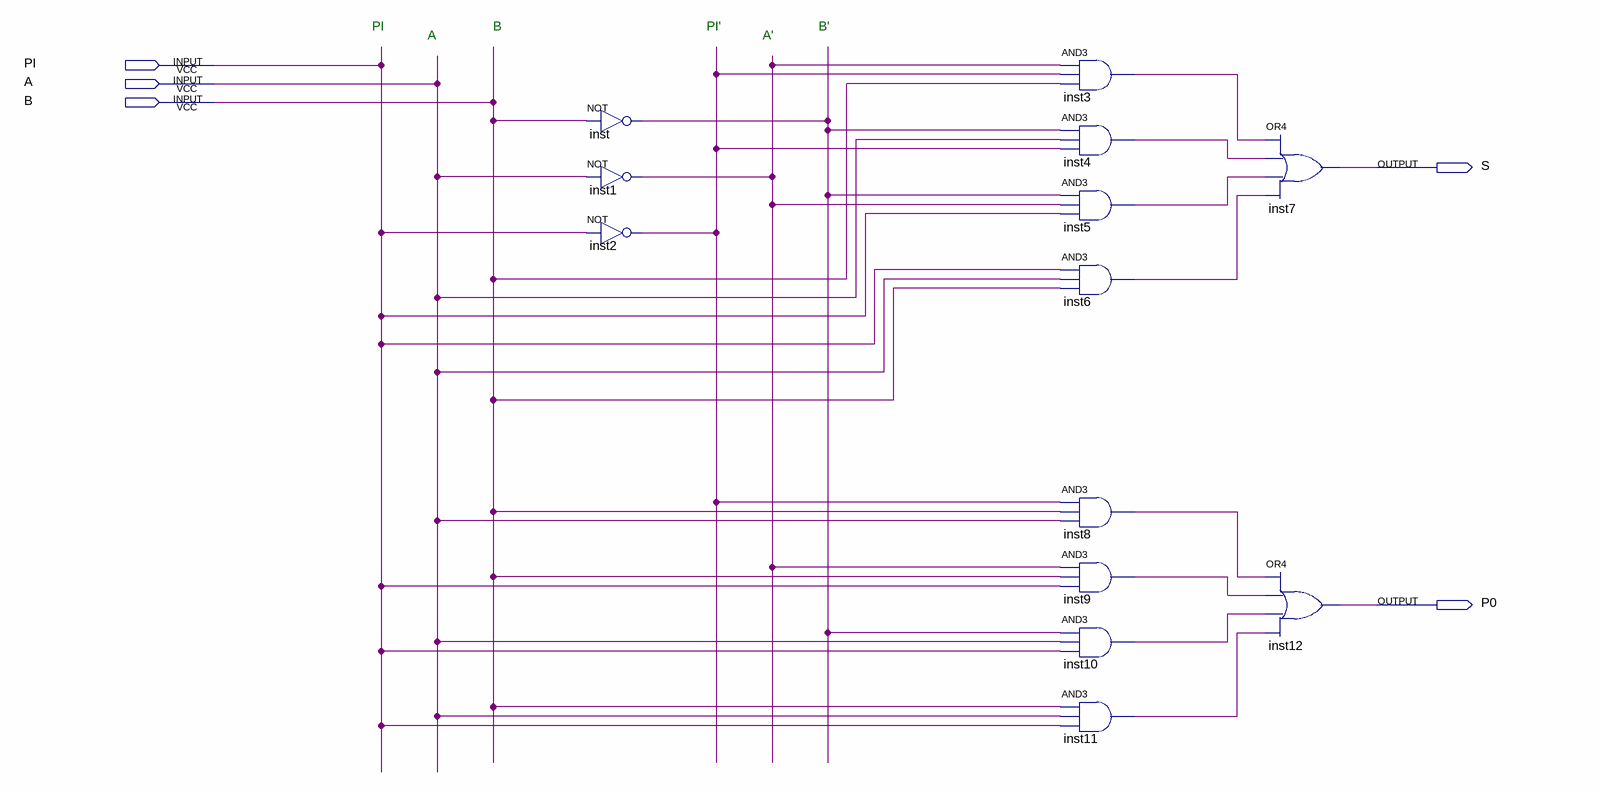
[diagram p0: schematic sheet]
// Quartus schematic Mark12.bdf as structural Verilog: 13 symbols, 5 pins
module Mark12 (
  input  PI,
  input  A,
  input  B,
  output S,
  output P0
);

  wire inst1_out, inst2_out, inst3_out, inst4_out, inst5_out, inst6_out, inst8_out, inst9_out, inst10_out,
       inst11_out, inst_out;

  not inst (inst_out, B);
  not inst1 (inst1_out, A);
  not inst2 (inst2_out, PI);
  and inst3 (inst3_out, inst1_out, inst2_out, B);
  and inst4 (inst4_out, inst_out, A, inst2_out);
  and inst5 (inst5_out, inst_out, inst1_out, PI);
  and inst6 (inst6_out, PI, A, B);
  and inst8 (inst8_out, inst2_out, B, A);
  and inst9 (inst9_out, inst1_out, B, PI);
  and inst10 (inst10_out, inst_out, A, PI);
  and inst11 (inst11_out, B, A, PI);
  or inst7 (S, inst3_out, inst4_out, inst5_out, inst6_out);
  or inst12 (P0, inst8_out, inst9_out, inst10_out, inst11_out);

  // Notes on the sheet:
  //   PI
  //   B
  //   PI'
  //   B'
  //   A
  //   A'
endmodule
